# EAGLE design MySens-easyESP32-V02b-001 (EAGLE 9.1.0)
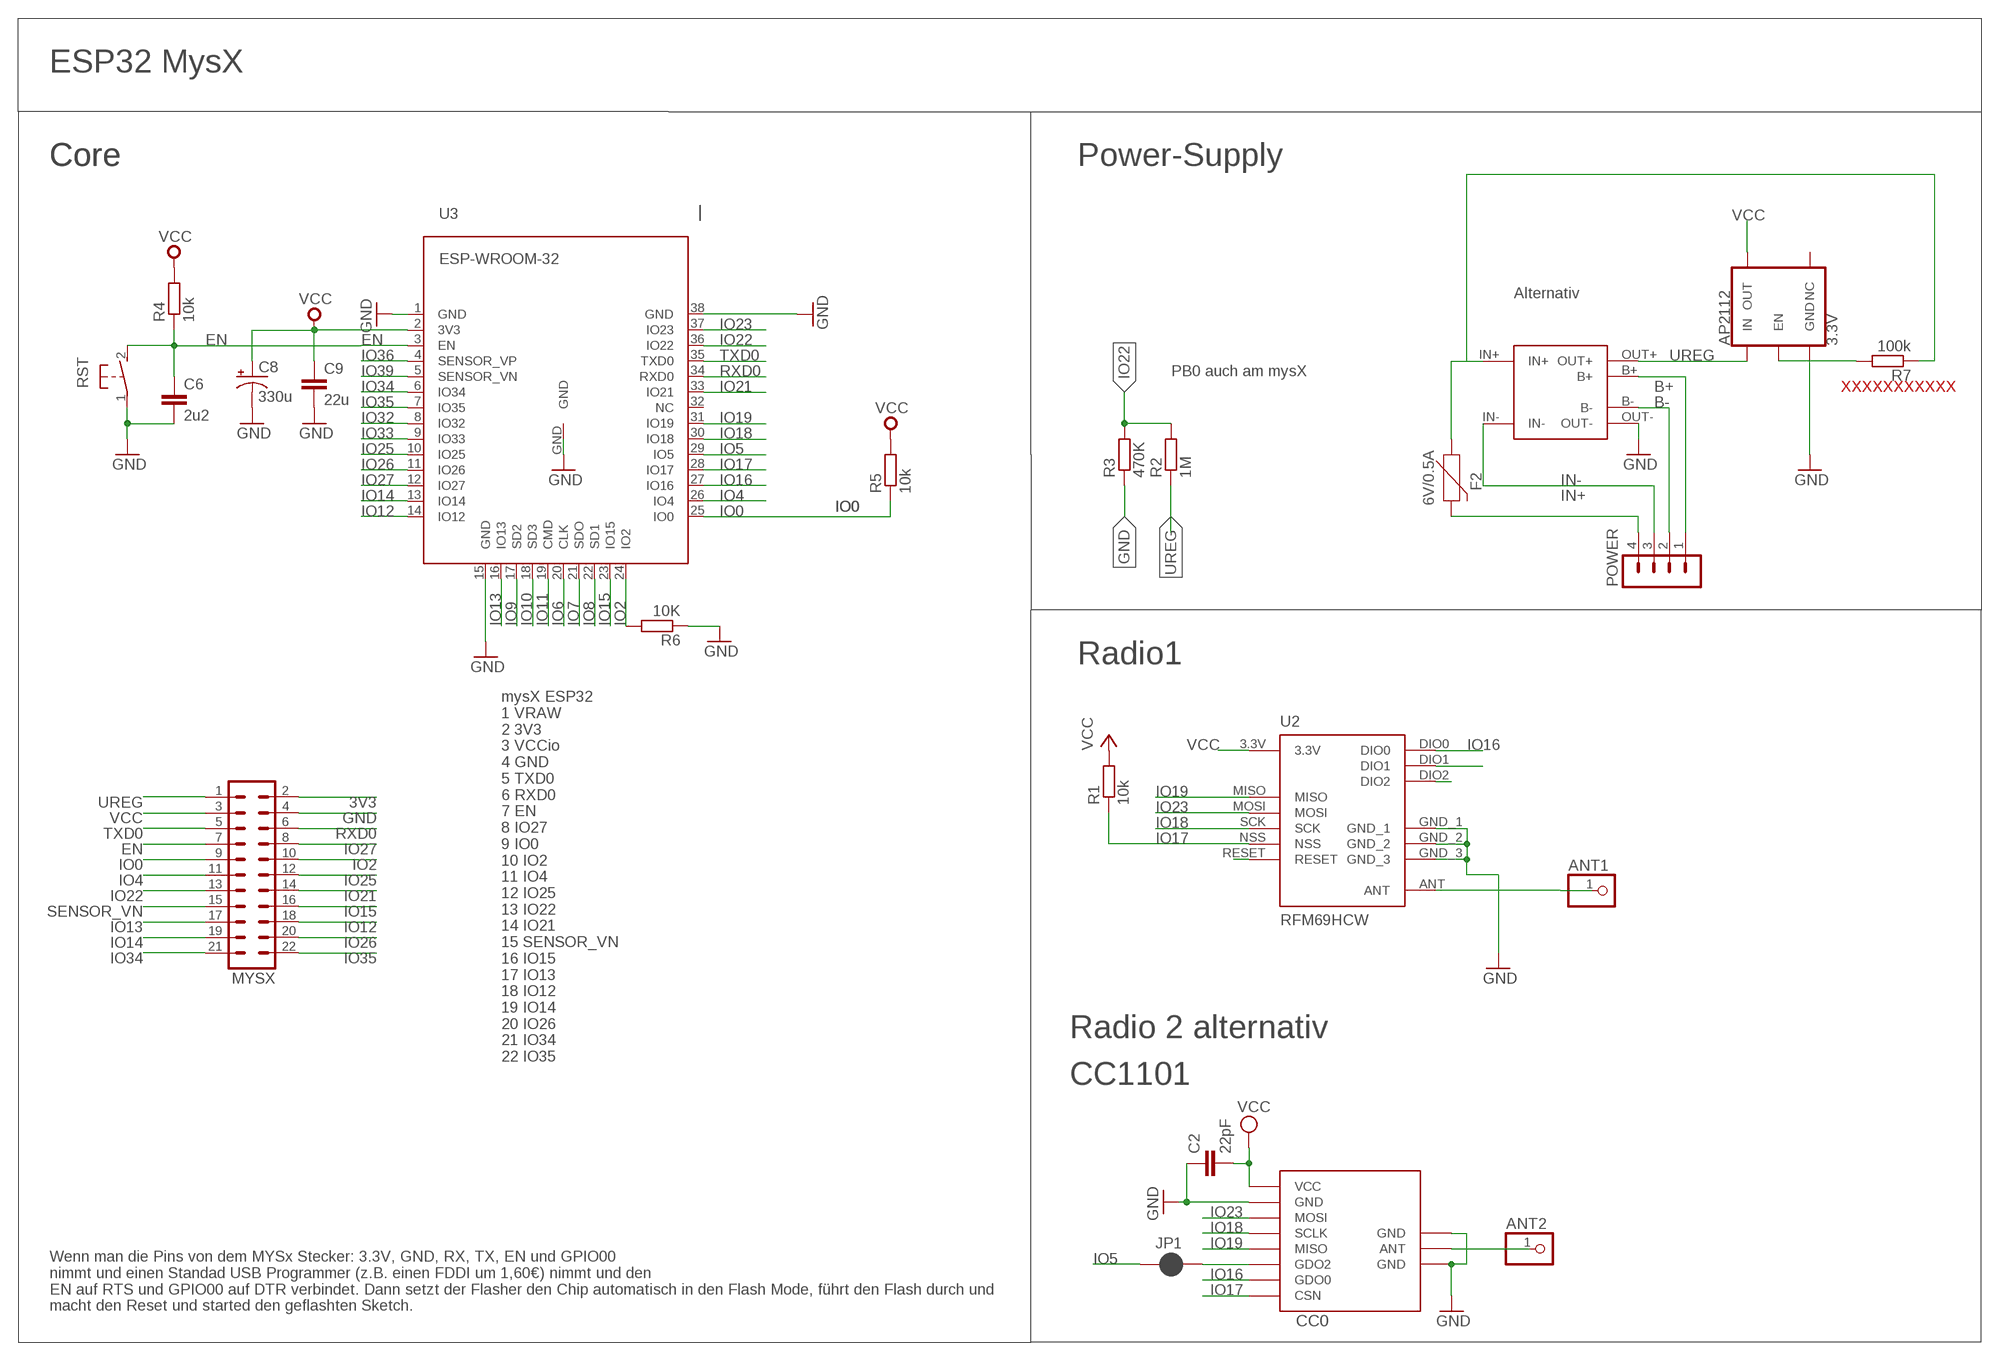
[diagram p0: schematic, sheet 1]

## Parts
ANT1  PINHD-1X1  [1X01]
ANT2  PINHD-1X1  [1X01]
AP2112  3.3V  V_REG_AP2112K-3.3V  [SOT23-5]
C2  22pF  C-EUC0805  [C0805]
C6  2u2  C-EUC0805  [C0805]
C8  330u  CAP_POLSMD  [VISHAY_C]
C9  22u  C-EUC0805  [C0805]
CC0  CC1101  CC1101_MODULE1SMD  [CC1101_MODULE1_SMD]
F2  6V/0.5A  PPTC_HALF-AMP  [1206]
JP1  JUMPER-SMT_2_NC_PASTE_NO-SILK  [SMT-JUMPER_2_NC_PASTE_NO-SILK]
MYSX  MA11-2  [MA11-2]
POWER  MA04-1  [MA04-1]
R1  10k  R-EU_M0805  [M0805]
R2  1M  R-EU_M0805  [M0805]
R3  470K  R-EU_M0805  [M0805]
R4  10k  R-EU_M0805  [M0805]
R5  10k  R-EU_R0603  [R0603]
R6  10K  R-EU_M0805  [M0805]
R7  100k  R-EU_M0805  [M0805]
RST  DTSM-3  [DTSM-3]
TP4056  TP4056-MODULE  [TP4056-LITHIUM-PROTECTED-MODULE]
U2  RFM69HCW  [RFM69HCW-XXXS2]
U3  ESP-WROOM-32  [ESP-WROOM-32]

## Nets
3V3: MYSX.2
ANT0: ANT2.1 CC0.ANT
ANT1: ANT1.1 U2.ANT
B+ [vcc]: POWER.1 TP4056.B+
B- [gnd]: POWER.2 TP4056.B-
EN: C6.1 MYSX.7 R4.1 RST.2 U3.3(EN)
GND [gnd]: AP2112.2(GND) C2.1 C6.2 C8.- C9.2 CC0.GND@0(GND) CC0.GND@1(GND) CC0.GND@2(GND) MYSX.4 R3.1 R6.1 RST.1 TP4056.OUT- U2.GND_1 U2.GND_2 U2.GND_3 U3.1(GND) U3.15(GND) U3.38(GND) U3.GND
IN+ [vcc]: F2.2 POWER.4
IN++ [vcc]: F2.1 R7.1 TP4056.IN+
IN- [gnd]: POWER.3 TP4056.IN-
IO0: MYSX.9 R5.1 U3.25(IO0)
IO2: MYSX.10 R6.2 U3.24(IO2)
IO4: MYSX.11 U3.26(IO4)
IO5: JP1.1 U3.29(IO5)
IO6: U3.20(CLK)
IO7: U3.21(SDO)
IO8: U3.22(SD1)
IO9: U3.17(SD2)
IO10: U3.18(SD3)
IO11: U3.19(CMD)
IO12: MYSX.18 U3.14(IO12)
IO13: MYSX.17 U3.16(IO13)
IO14: MYSX.19 U3.13(IO14)
IO15: MYSX.16 U3.23(IO15)
IO16: CC0.GDO0 U2.DIO0 U3.27(IO16)
IO17: CC0.CSN R1.1 U2.NSS U3.28(IO17)
IO18: CC0.SCLK U2.SCK U3.30(IO18)
IO19: CC0.MISO U2.MISO U3.31(IO19)
IO21: MYSX.14 U3.33(IO21)
IO22: MYSX.13 R2.2 R3.2 U3.36(IO22)
IO23: CC0.MOSI U2.MOSI U3.37(IO23)
IO25: MYSX.12 U3.10(IO25)
IO26: MYSX.20 U3.11(IO26)
IO27: MYSX.8 U3.12(IO27)
IO32: U3.8(IO32)
IO33: U3.9(IO33)
IO34: MYSX.21 U3.6(IO34)
IO35: MYSX.22 U3.7(IO35)
IO36: U3.4(SENSOR_VP)
IO39: U3.5(SENSOR_VN)
MAYBE_IO5: CC0.GDO2 JP1.2
N$4: U2.DIO2
N$8: U2.DIO1
N$9: U2.RESET
N$12: AP2112.3(EN) R7.2
RXD0: MYSX.6 U3.34(RXD0)
SENSOR_VN: MYSX.15
TXD0: MYSX.5 U3.35(TXD0)
UREG [gnd]: AP2112.1(IN) MYSX.1 R2.1 TP4056.OUT+
VCC [gnd]: AP2112.5(OUT) C2.2 C8.+ C9.1 CC0.VCC MYSX.3 R1.2 R4.2 R5.2 U2.3.3V U3.2(3V3)
Unconnected: AP2112.4(NC) U3.32(NC)

## Notes on the sheet
- ESP32 MysX
- Core | Core | Power-Supply
- Alternativ
- PB0 auch am mysX
- XXXXXXXXXXX
- Radio1
- Radio 2 alternativ
- mysX ESP32
  1 VRAW
  2 3V3
  3 VCCio
  4 GND
  5 TXD0
  6 RXD0
  7 EN
  8 IO27
  9 IO0
  10 IO2
  11 IO4
  12 IO25
  13 IO22
  14 IO21
  15 SENSOR_VN
  16 IO15
  17 IO13
  18 IO12
  19 IO14
  20 IO26
  21 IO34
  22 IO35
- CC1101
- Wenn man die Pins von dem MYSx Stecker: 3.3V, GND, RX, TX, EN und GPIO00
  nimmt und einen Standad USB Programmer (z.B. einen FDDI um 1,60€) nimmt und den
  EN auf RTS und GPIO00 auf DTR verbindet. Dann setzt der Flasher den Chip automatisch in den Flash Mode, führt den Flash durch und
  macht den Reset und started den geflashten Sketch.

## Library data of the parts
ANT1 ANT2 = pinhead:PINHD-1X1: PIN HEADER
AP2112 = SparkFun-IC-Power:V_REG_AP2112: AP2112 - 600mA CMOS LDO Regulator w/ Enable The AP2112 is CMOS process low dropout linear regulator with enable function, the regulator delivers a guaranteed 600mA (min.) continuous load current. Features Output Voltage Accuracy: ±1.5% Output Current: 600mA (Min.) Foldback Short Current Protection: 50mA Enable Function to Turn ON/OFF VOUT Low Dropout Voltage (3.3V): 250mV (Typ.) @IOUT=600mA Excellent Load Regulation: 0.2%/A (Typ.) Excellent Line Regulation: 0.02%/V (Typ.) Low Quiescent Current: 55μA (Typ.) Low Standby Current: 0.01μA (Typ.) Low Output Noise: 50μVRMS PSRR: 100Hz -65dB, 1kHz -65dB OTSD Protection Stable with 1.0μF Flexible Cap: Ceramic, Tantalum and Aluminum Electrolytic Operation Temperature Range: -40°C to 85°C ESD: MM 400V, HBM 4000V; PROD_ID: VREG-12457
C2 = rcl:C-EU: CAPACITOR, European symbol
C6 C9 = rcl@1:C-EU: CAPACITOR, European symbol; SPICEPREFIX: C
C8 = SparkFun-Passives:CAP_POL: Capacitor Polarized These are standard SMD and PTH capacitors. Normally 10uF, 47uF, and 100uF in electrolytic and tantalum varieties. Always verify the external diameter of the through hole cap, it varies with capacity, voltage, and manufacturer. The EIA devices should be standard.
CC0 = wireless:CC1101_MODULE1: CC1101 wireless module for 433/868 MHz (sold from Aliexpress). DIL version for mounting with pin header (and SMD soldering) and SMD only variant available.
F2 = SparkFun-Fuses:PPTC: Resettable Fuse PPTC Resettable Fuse. Really a sort of resistor with a polymeric positive temperature coefficient whose resistance increases dramatically with an increase in temperature. When heated by the power passing through the resistance rises causing the current to be limited, protecting the circuit. This is achieved by the transition of the polymer from a crystalline to an amorphous state where the conductive carbon separates breaking the conductive pathways found in the cool crystalline structure. When a PPTC cools back down it resumes conducting letting the circuit turn back on. SparkFun Products: SparkFun RedBoard - Programmed with Arduino <https://www.sparkfun.com/products/12757> Pro Micro - 5V/16MHz <https://www.sparkfun.com/products/12640> Arduino Pro 328 - 5V/16MHz <https://www.sparkfun.com/products/10915> MP3 Trigger <https://www.sparkfun.com/products/13720>; PROD_ID: RES-08585
JP1 = SparkFun-Jumpers:JUMPER-SMT_2_NC_PASTE: Normally closed solder jumper This jumper has an aperture in the stencil to allow solder paste to bridge the split in the wire so it's normally closed (NC). Wick off the solder to open the connection. Reapply solder to reclose the connection.
MYSX = con-Pinheader:MA11-2: PIN HEADER; OC_FARNELL: unknown; OC_NEWARK: unknown
POWER = con-lstb:MA04-1: PIN HEADER; OC_FARNELL: unknown; OC_NEWARK: unknown
R1-R3 R5-R7 = rcl:R-EU_: RESISTOR, European symbol
R4 = rcl@1:R-EU_: RESISTOR, European symbol; SPICEPREFIX: R
RST = switch-tact:DTSM-3
TP4056 = tp2112-usw-V2:TP4056-MODULE
U2 = doug:RFM69H
U3 = esp32:ESP-WROOM-32

## Net classes
0 default: width 0.305 mm, clearance 0.205 mm
1 gnd: width 0.457 mm, drill 0.635 mm, clearance 0.254 mm
2 vcc: width 0.406 mm, drill 0.406 mm, clearance 0.254 mm

## Board
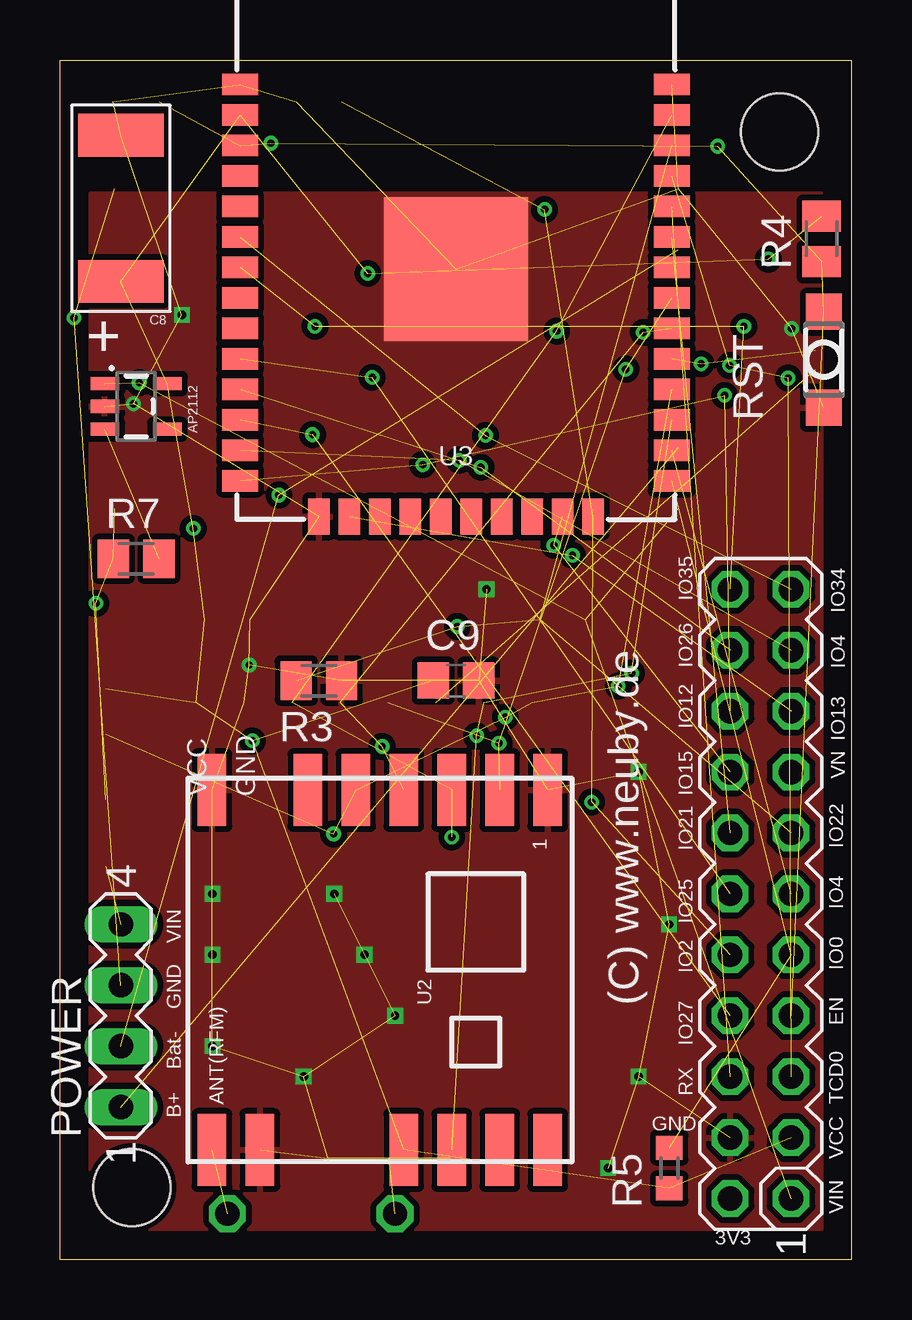
[diagram p1: board, top side]
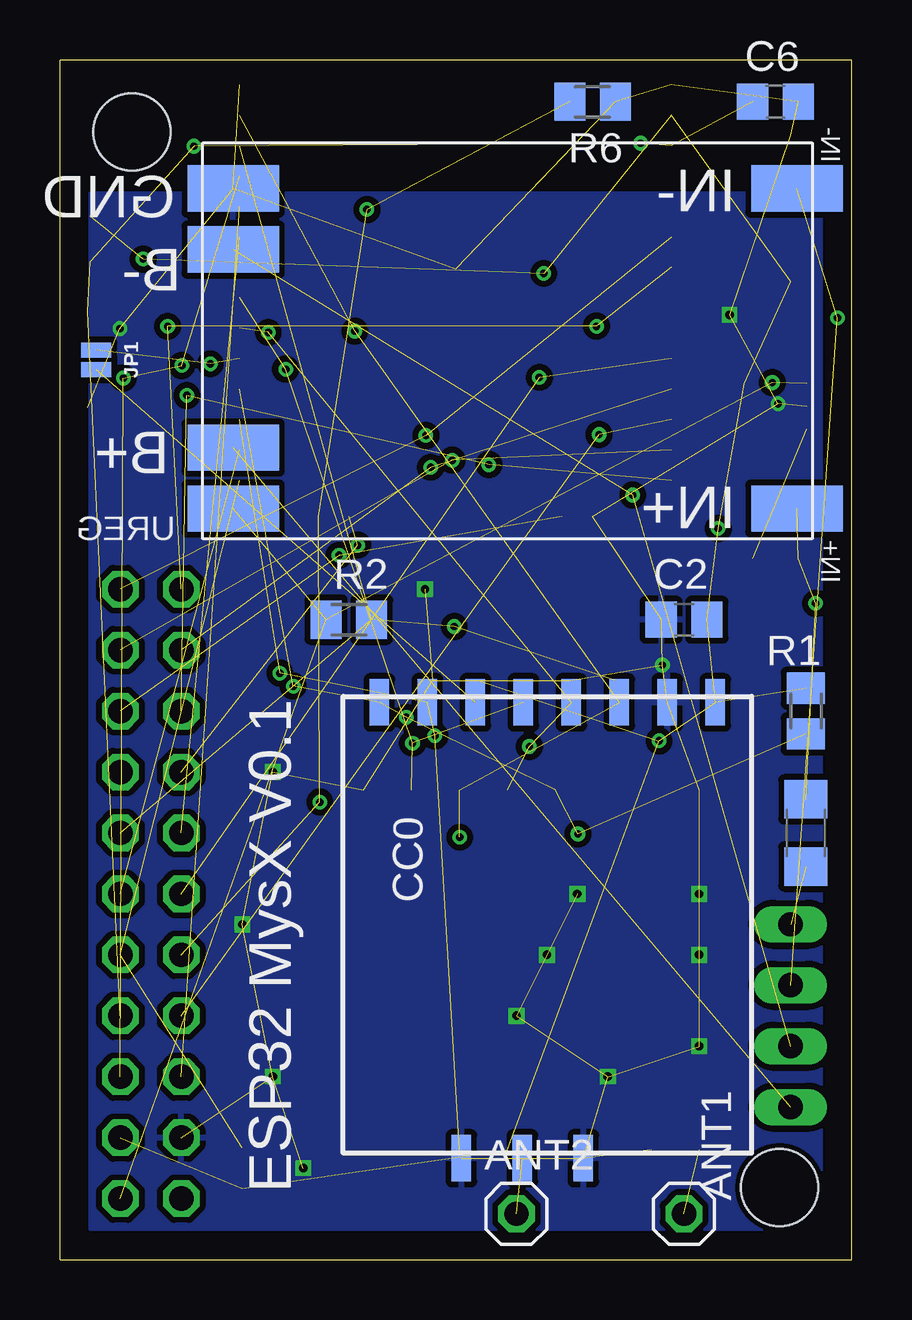
[diagram p2: board, bottom side, seen from below]

Size 33 x 50 mm. Coordinates in mm from the lower left corner, seen from the top.
Outline: 0,0 0,50 33,50 33,0 0,0
Copper layers (1*16): Top 0.035mm / dielectric 1.5mm / Bottom 0.035mm
Design rules "dirt_cheap_dirty_boards.v1": minimum track width 5mil, minimum drill 12mil, track to track 5mil, track to pad 5mil, pad to pad 5mil, via to via 5mil, smd to smd 0mil, copper to edge 10mil, drill to drill 10mil, minimum pad ring 10mil, minimum via ring 6mil, stop-mask expansion 2mil, vias tented up to drill 25mil, thermal gap 10mil
Holes 3.2 mm at 3,3 30,47

### Footprints (pad centres in the part's own frame; a part is rotated, then mirrored left to right if it is on the bottom)
1X01 = drill 1.016 octagon: 1 0,0
SOT23-5 = smd 0.55 x 1.2: 1 -0.95,-1.3; 2 0,-1.3; 3 0.95,-1.3; 4 0.95,1.3; 5 -0.95,1.3
C0805 = smd 1.3 x 1.5: 1 -0.95,0; 2 0.95,0
VISHAY_C = smd 3.556 x 1.778: + 0,3.048; - 0,-3.048
CC1101_MODULE1_SMD = smd 1.93 x 0.813: ANT 19,5.96; CSN 0,0; GDO0 0,2; GDO2 0,4; GND@0 0,12; GND@1 19,8.5; GND@2 19,3.42; MISO 0,6; MOSI 0,10; SCLK 0,8; VCC 0,14
1206 = smd 1.6 x 1.8: 1 -1.4,0; 2 1.4,0
SMT-JUMPER_2_NC_PASTE_NO-SILK = smd 0.635 x 1.27: 1 -0.406,0; 2 0.406,0
MA11-2 = drill 1.016 octagon: 1 -12.7,-1.27; 2 -12.7,1.27; 3 -10.16,-1.27; 4 -10.16,1.27; 5 -7.62,-1.27; 6 -7.62,1.27; 7 -5.08,-1.27; 8 -5.08,1.27; 9 -2.54,-1.27; 10 -2.54,1.27; 11 0,-1.27; 12 0,1.27; 13 2.54,-1.27; 14 2.54,1.27; 15 5.08,-1.27; 16 5.08,1.27; 17 7.62,-1.27; 18 7.62,1.27; 19 10.16,-1.27; 20 10.16,1.27; 21 12.7,-1.27; 22 12.7,1.27
MA04-1 = drill 1.016 long: 1 -3.81,0; 2 -1.27,0; 3 1.27,0; 4 3.81,0
M0805 = smd 1.3 x 1.6: 1 -0.95,0; 2 0.95,0
R0603 = smd 1 x 1.1: 1 -0.85,0; 2 0.85,0
DTSM-3 = smd 1.5 x 1.5: 1 -2,0; 2 2,0
TP4056-LITHIUM-PROTECTED-MODULE = smd 3.81 x 1.93: B+ 11.43,4.445; B- 11.43,-3.81; IN+ -12.065,6.985; IN- -12.065,-6.35; OUT+ 11.43,6.985; OUT- 11.43,-6.35
RFM69HCW-XXXS2 = smd 3 x 1.2: 3.3V 7.5,1; ANT 7.5,-7; DIO0 7.5,3; DIO1 7.5,5; DIO2 7.5,7; GND_1 7.5,-5; GND_2 -7.5,-7; GND_3 -7.5,7; MISO -7.5,5; MOSI -7.5,3; NSS -7.5,-1; RESET -7.5,-3; SCK -7.5,1
ESP-WROOM-32 = smd 0.9 x 1.5: 1 7.7,9; 2 6.43,9; 3 5.16,9; 4 3.89,9; 5 2.62,9; 6 1.35,9; 7 0.08,9; 8 -1.19,9; 9 -2.46,9; 10 -3.73,9; 11 -5,9; 12 -6.27,9; 13 -7.54,9; 14 -8.81,9; 25 -8.81,-9; 26 -7.54,-9; 27 -6.27,-9; 28 -5,-9; 29 -3.73,-9; 30 -2.46,-9; 31 -1.19,-9; 32 0.08,-9; 33 1.35,-9; 34 2.62,-9; 35 3.89,-9; 36 5.16,-9; 37 6.43,-9; 38 7.7,-9 | smd 1.5 x 0.9: 15 -10.3,5.715; 16 -10.3,4.445; 17 -10.3,3.175; 18 -10.3,1.905; 19 -10.3,0.635; 20 -10.3,-0.635; 21 -10.3,-1.905; 22 -10.3,-3.175; 23 -10.3,-4.445; 24 -10.3,-5.715 | smd 6 x 6: GND 0,0

### Placement (x,y rotation side)
ANT1  6.99,1.91 0 bottom
ANT2  13.97,1.91 0 bottom
AP2112  3.17,35.56 270 top
C2  6.99,26.67 0 bottom
C6  3.17,48.26 0 bottom
C8  2.54,43.81 180 top
C9  16.51,24.13 0 top
CC0  19.68,23.23 270 bottom
F2  1.91,17.78 270 bottom
JP1  31.49,37.5 270 bottom
MYSX  29.21,15.24 90 top
POWER  2.54,10.16 90 top
R1  1.91,22.86 90 bottom
R2  20.95,26.67 0 bottom
R3  10.79,24.13 180 top
R4  31.75,42.55 90 top
R5  25.4,3.81 270 top
R6  10.79,48.26 180 bottom
R7  3.17,29.21 0 top
RST  31.84,37.51 90 top
TP4056  14.35,38.29 180 bottom
U2  13.34,12.06 270 top
U3  16.51,41.27 90 top

### Tracks (layer width: path | path; a pad name or v marks a point on that pad's centre or on a via)
ANT0  (1 unrouted)
ANT1  (1 unrouted)
B+  (1 unrouted)
B-  (via drill 0.3 pad 0.61)  (2 unrouted)
  other vias: 9.12,31.87
EN  (via drill 0.3 pad 0.61)  (6 unrouted)
  other vias: 27.42,46.41 8.79,46.53
GND  (via drill 0.3 pad 0.61, 0.35)  (35 unrouted)
  other vias: 3.06,35.67 30.5,38.8 7.88,24.78 6.35,8.89 6.35,15.24 6.35,12.7 11.43,15.24 12.7,12.7 13.97,10.16 10.16,7.62 22.86,3.81 24.13,7.62 25.4,13.97 24.13,20.32 17.78,27.94 5.08,39.37
  pour Top: 1.27,1.27 1.27,44.45 31.75,44.45 31.75,1.27
  pour Bottom: 1.27,1.27 1.27,44.45 31.75,44.45 31.75,1.27
IN+  (1 unrouted)
IN++  (via drill 0.3 pad 0.61)  (3 unrouted)
  other vias: 1.5,27.35
IN-  (via drill 0.3 pad 0.61)  (2 unrouted)
  other vias: 0.58,39.25
IO0  (2 unrouted)
IO2  (via drill 0.3 pad 0.61)  (4 unrouted)
  other vias: 20.2,43.76 22.17,19.07
IO4  (1 unrouted)
IO5  (via drill 0.3 pad 0.61)  (2 unrouted)
  other vias: 26.73,37.33
IO12  (via drill 0.3 pad 0.61)  (3 unrouted)
  other vias: 27.71,36.01 15.12,33.13
IO13  (via drill 0.3 pad 0.61)  (2 unrouted)
  other vias: 21.36,29.35
IO14  (via drill 0.3 pad 0.61)  (2 unrouted)
  other vias: 16.65,33.32
IO15  (via drill 0.3 pad 0.61)  (2 unrouted)
  other vias: 20.59,29.78
IO16  (via drill 0.3 pad 0.61)  (4 unrouted)
  other vias: 23.83,24.44 17.37,21.83
IO17  (via drill 0.3 pad 0.61)  (6 unrouted)
  other vias: 23.28,23.9 18.56,22.6 11.41,17.74
IO18  (via drill 0.3 pad 0.61)  (4 unrouted)
  other vias: 24.31,38.65 13.43,21.39
IO19  (via drill 0.3 pad 0.61)  (4 unrouted)
  other vias: 23.59,37.11 18.3,21.52
IO21  (1 unrouted)
IO22  (via drill 0.3 pad 0.61)  (4 unrouted)
  other vias: 16.57,26.39
IO23  (via drill 0.3 pad 0.61)  (4 unrouted)
  other vias: 20.71,38.7 16.34,17.61
IO25  (via drill 0.3 pad 0.61)  (2 unrouted)
  other vias: 13.01,36.77
IO26  (via drill 0.3 pad 0.61)  (2 unrouted)
  other vias: 17.55,33.02
IO27  (via drill 0.3 pad 0.61)  (2 unrouted)
  other vias: 10.53,34.39
IO34  (via drill 0.3 pad 0.61)  (2 unrouted)
  other vias: 17.74,34.35
IO35  (via drill 0.3 pad 0.61)  (3 unrouted)
  other vias: 28.51,38.9 10.63,38.9
MAYBE_IO5  (1 unrouted)
N$12  (1 unrouted)
RXD0  (1 unrouted)
TXD0  (via drill 0.3 pad 0.61)  (3 unrouted)
  other vias: 30.36,36.74 27.92,37.26
UREG  (via drill 0.3 pad 0.61)  (4 unrouted)
  other vias: 3.3,36.55
VCC  (via drill 0.3 pad 0.61)  (14 unrouted)
  other vias: 8.02,21.62 29.53,41.7 12.83,41.1 5.56,30.47

### Text on the board
tNames: IO35 | IO34 | IO26 | IO4 | (C) www.neuby.de | IO12 | IO13 | IO15 | VN | VCC | GND | IO21 | IO22 | IO25 | VIN | IO4 | IO2 | GND | IO0 | ANT(RFM) | IO27 | Bat- | EN | RX | B+ | GND | TCD0 | VCC | VIN | 3V3
bNames: IN- | IN- | GND | B- | B+ | IN+ | UREG | IN+ | ESP32 MysX V0.1
Document: DS_1551K